# EAGLE design mainboard (EAGLE 7.2.0)
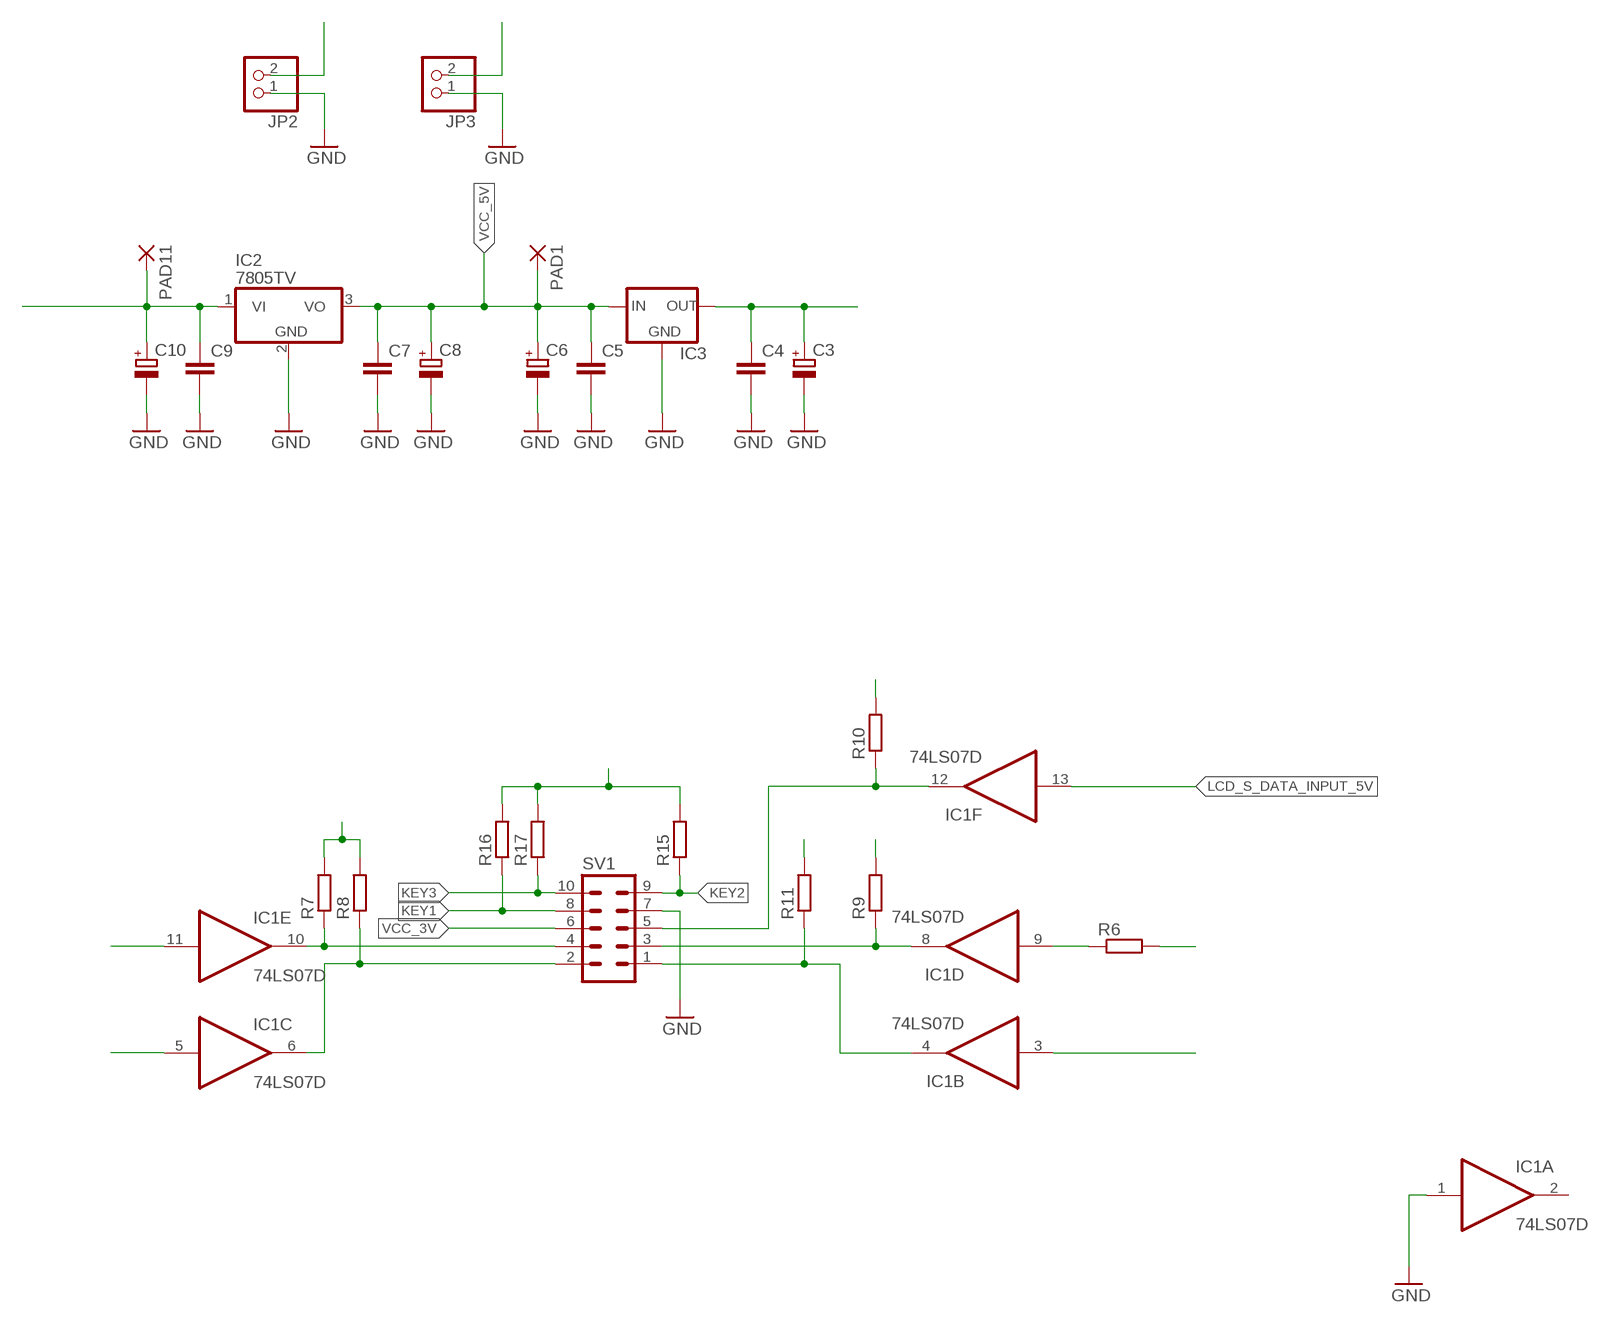
[diagram p0: schematic, sheet 1, part 1 of 2]
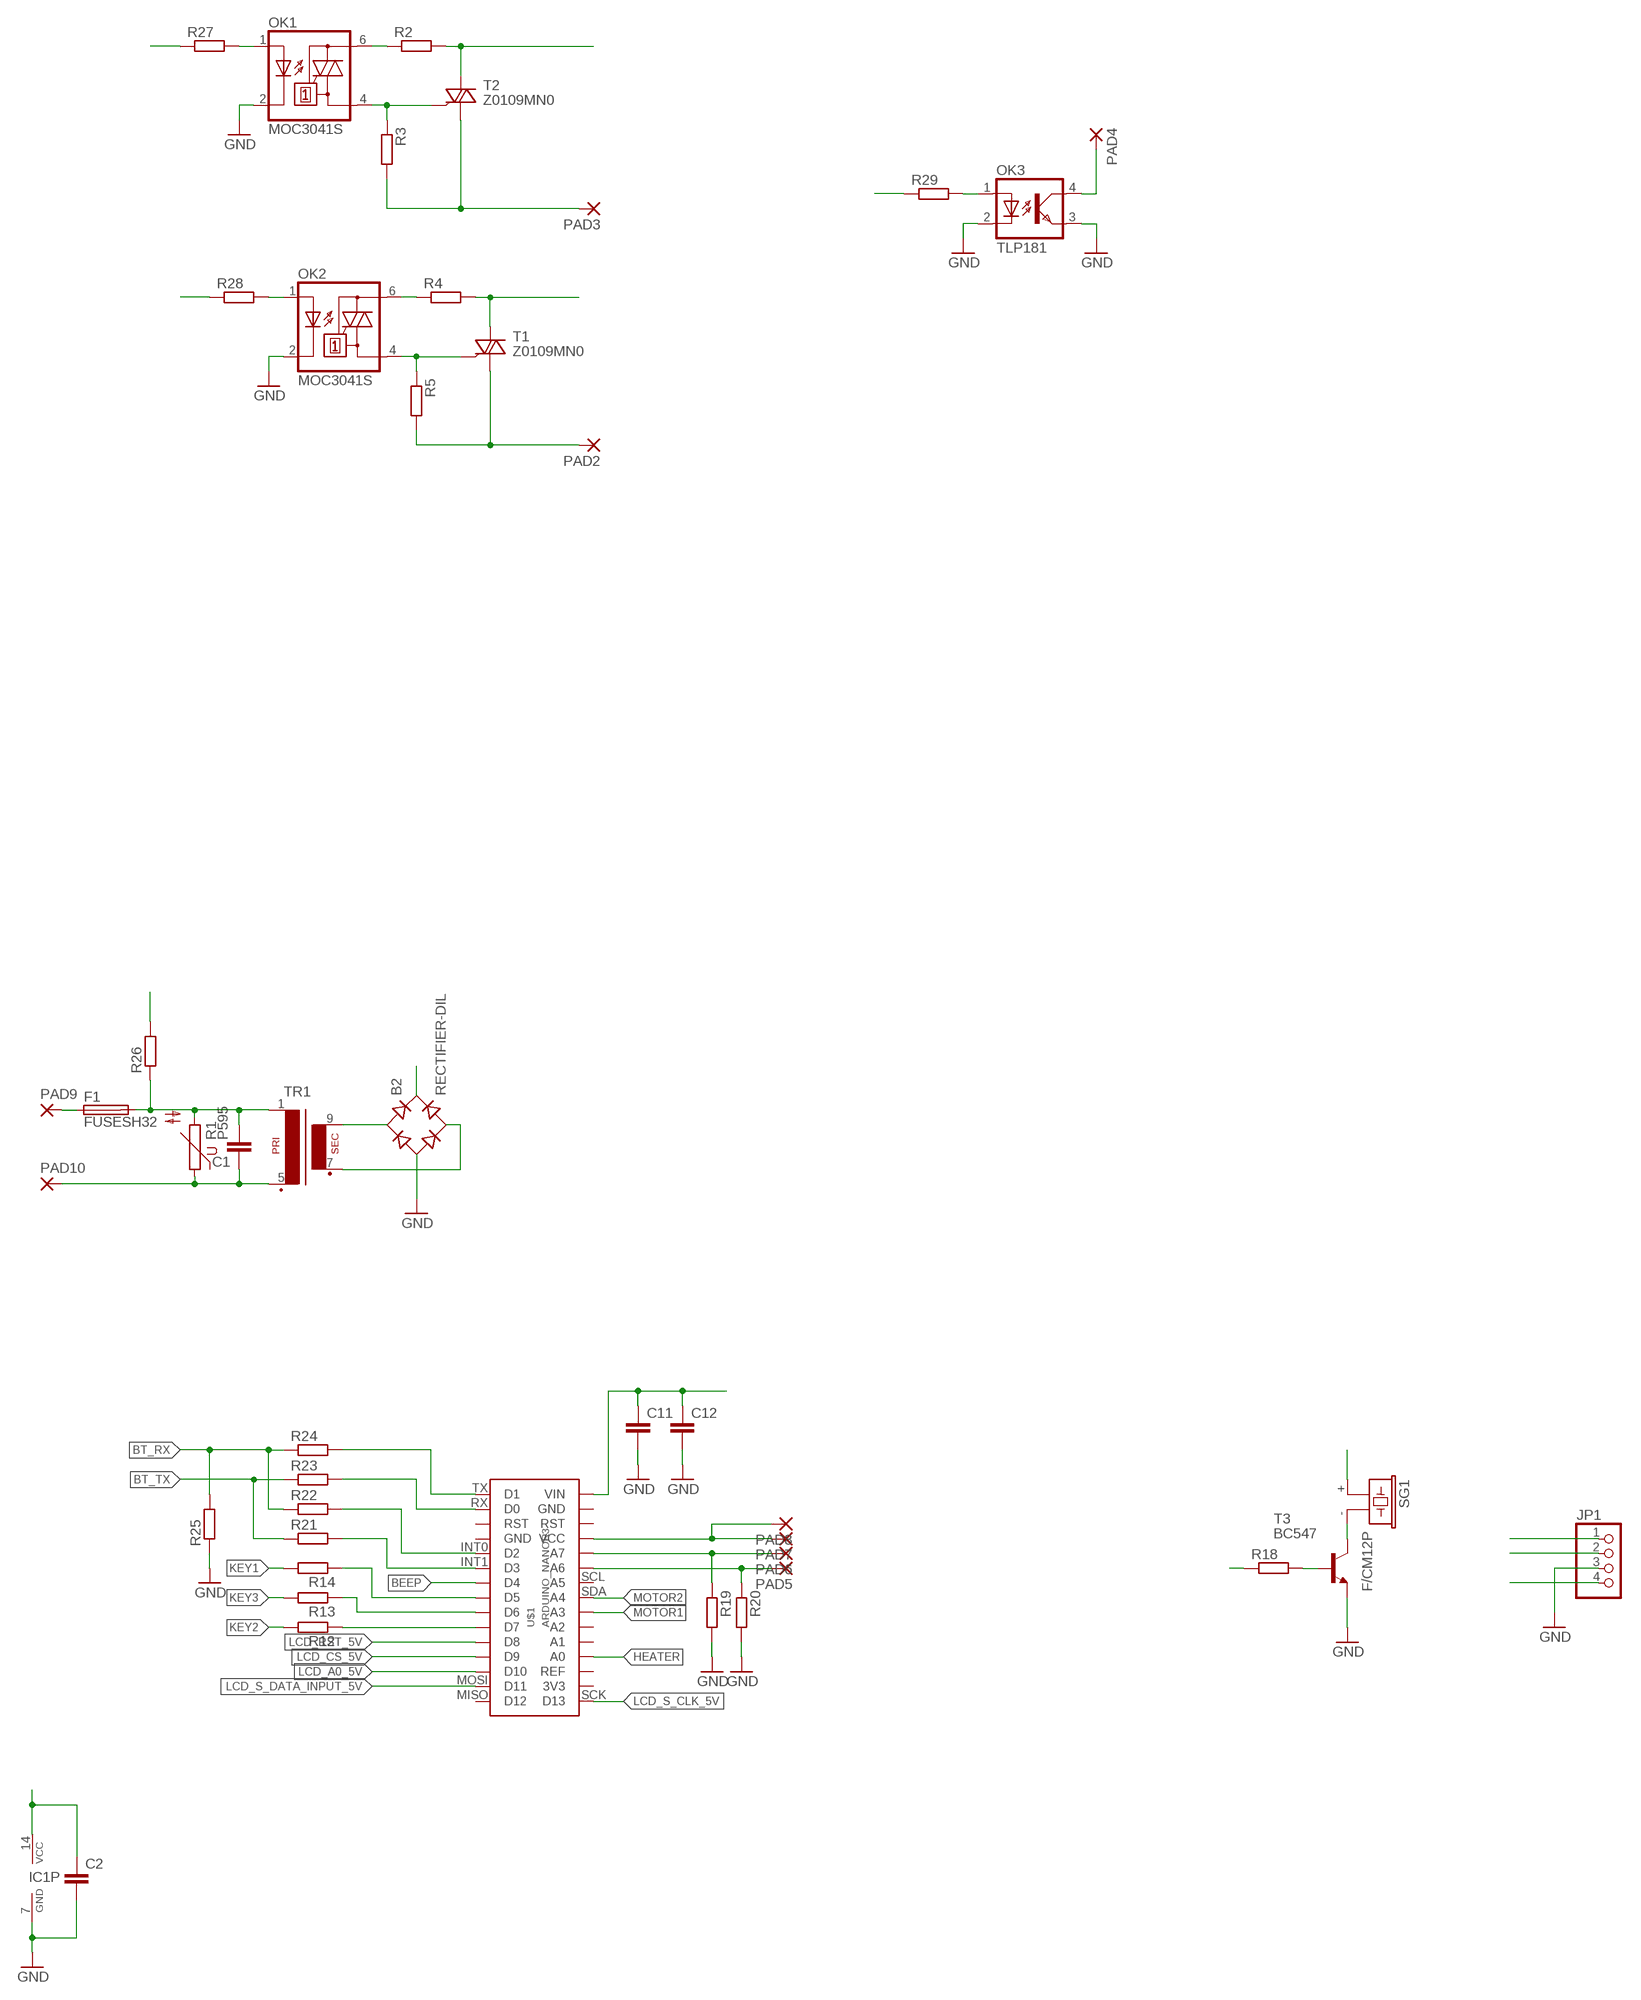
[diagram p1: schematic, sheet 1, part 2 of 2]

## Parts
B2  RECTIFIER-DIL  [B-DIL]
C1  C-EU150-054X183  [C150-054X183]
C2  C-EUC1206  [C1206]
C3  CPOL-EUSMCB  [SMC_B]
C4  C-EUC0603  [C0603]
C5  C-EUC0603  [C0603]
C6  CPOL-EUSMCB  [SMC_B]
C7  C-EUC1206  [C1206]
C8  CPOL-EUSMCC  [SMC_C]
C9  C-EUC1206  [C1206]
C10  CPOL-EU150CLZ-0810  [150CLZ-0810]
C11  C-EUC1206  [C1206]
C12  C-EUC1206  [C1206]
F1  FUSESH32  [SH32]
IC1  74LS07D  [SO14]
IC2  7805TV  [TO220V]
IC3  78XXS  [78XXS]
JP1  PINHD-1X4  [1X04]
JP2  PINHD-1X2  [1X02]
JP3  PINHD-1X2  [1X02]
OK1  MOC3041S  [DIL6-SMD]
OK2  MOC3041S  [DIL6-SMD]
OK3  TLP181  [SO-4]
PAD1  2,54/1,1  [2,54/1,1]
PAD2  2,54/1,1  [2,54/1,1]
PAD3  2,54/1,1  [2,54/1,1]
PAD4  2,54/1,1  [2,54/1,1]
PAD5  2,54/1,1  [2,54/1,1]
PAD6  2,54/1,1  [2,54/1,1]
PAD7  2,54/1,1  [2,54/1,1]
PAD8  2,54/1,1  [2,54/1,1]
PAD9  3,81/1,4  [3,81/1,4]
PAD10  3,81/1,4  [3,81/1,4]
PAD11  2,54/1,1  [2,54/1,1]
R1  P595  [P595]
R2  R-EU_R1206  [R1206]
R3  R-EU_R1206  [R1206]
R4  R-EU_R1206  [R1206]
R5  R-EU_R1206  [R1206]
R6  R-EU_R0603  [R0603]
R7  R-EU_R0603  [R0603]
R8  R-EU_R0603  [R0603]
R9  R-EU_0204/5  [0204/5]
R10  R-EU_0204/7  [0204/7]
R11  R-EU_R0603  [R0603]
R12  R-EU_0204/7  [0204/7]
R13  R-EU_0204/7  [0204/7]
R14  R-EU_0204/7  [0204/7]
R15  R-EU_R0603  [R0603]
R16  R-EU_R0603  [R0603]
R17  R-EU_R0603  [R0603]
R18  R-EU_0207/10  [0207/10]
R19  R-EU_0204/5  [0204/5]
R20  R-EU_0204/5  [0204/5]
R21  R-EU_R0603  [R0603]
R22  R-EU_R0603  [R0603]
R23  R-EU_R0603  [R0603]
R24  R-EU_R0603  [R0603]
R25  R-EU_R0603  [R0603]
R26  R-EU_VTA53  [VTA53]
R27  R-EU_0204/7  [0204/7]
R28  R-EU_0204/5  [0204/5]
R29  R-EU_R0603  [R0603]
SG1  F/CM12P  [F/CM12P]
SV1  ML10  [ML10]
T1  Z0109MN0  [SOT223]
T2  Z0109MN0  [SOT223]
T3  BC547  [TO92]
TR1  EI30-1  [EI30-1]
U$1  ARDUINO_NANOR3  [ARDUINO-NANO]

## Nets
BEEP: R18.1 U$1.D4
BT_RX: JP1.1 R22.1 R24.1 R25.2
BT_TX: JP1.2 R21.1 R23.1
G: OK2.4(A1) R5.1 T1.3(G)
GND: B2.- C2.2 C3.- C4.2 C5.2 C6.- C7.2 C8.- C9.2 C10.- C11.2 C12.2 IC1.1(A:I) IC1.7(P:GND) IC2.2(GND) IC3.GND JP1.3 JP2.1 JP3.1 OK1.2(C) OK2.2(C) OK3.2(C) OK3.3(EMIT) R19.2 R20.2 R25.1 SV1.7 T3.1(E)
HEATER: R29.1 U$1.A0
KEY1: R14.2 R16.1 SV1.8
KEY2: R12.2 R15.1 SV1.9
KEY3: R13.2 R17.1 SV1.10
LCD_A0: IC1.8(D:O) R9.1 SV1.3
LCD_A0_5V: R6.2 U$1.D10
LCD_CS_3V: IC1.4(B:O) R11.1 SV1.1
LCD_CS_5V: IC1.3(B:I) U$1.D9
LCD_RST_3V: IC1.6(C:O) R8.1 SV1.2
LCD_RST_5V: IC1.5(C:I) U$1.D8
LCD_S_CLK: IC1.10(E:O) R7.1 SV1.4
LCD_S_CLK_5V: IC1.11(E:I) U$1.SCK(D13)
LCD_S_DATA_INPUT: IC1.12(F:O) R10.1 SV1.5
LCD_S_DATA_INPUT_5V: IC1.13(F:I) U$1.MOSI(D11)
MOTOR1: R27.1 U$1.A3
MOTOR2: R28.1 U$1.SDA(A4)
N$1: C1.1 PAD10.1(P) R1.1 TR1.5(P2)
N$2: C1.2 F1.2A R1.2 R26.1 TR1.1
N$3: B2.AC1 TR1.9(S4)
N$4: B2.AC2 TR1.7(S3)
N$5: OK1.6(A2) R2.1
N$6: OK1.4(A1) R3.1 T2.3(G)
N$7: OK2.6(A2) R4.1
N$8: R21.2 U$1.INT1(D3)
N$10: F1.1A PAD9.1(P)
N$11: IC1.9(D:I) R6.1
N$12: R12.1 U$1.D7
N$13: R13.1 U$1.D6
N$14: R14.1 U$1.D5
N$15: PAD5.1(P) R20.1 U$1.A6
N$16: PAD6.1(P) R19.1 U$1.A7
N$17: R22.2 U$1.INT0(D2)
N$18: R23.2 U$1.RX(D0)
N$19: R24.2 U$1.TX(D1)
N$20: SG1.- T3.3(C)
N$22: R18.2 T3.2(B)
N$23: OK1.1(A) R27.2
N$24: OK2.1(A) R28.2
N$25: OK3.1(A) R29.2
N$26: OK3.4(COL) PAD4.1(P)
N$30: PAD2.1(P) R5.2 T1.2(CM) T1.4(CM)
N$31: PAD3.1(P) R3.2 T2.2(CM) T2.4(CM)
VCC_3V: C3.+ C4.1 IC3.OUT R7.2 R8.2 R9.2 R10.2 R11.2 SV1.6
VCC_5V: C5.1 C6.+ C7.1 C8.+ IC2.3(VO) IC3.IN JP1.4 JP2.2 PAD1.1(P) R15.2 R16.2 R17.2 SG1.+
VCC_5V_ARDUINO: C2.1 IC1.14(P:VCC) PAD7.1(P) PAD8.1(P) U$1.VCC
VIN: B2.+ C9.1 C10.+ C11.1 C12.1 IC2.1(VI) JP3.2 PAD11.1(P) U$1.VIN
WN: R2.2 R4.2 R26.2 T1.1(LD) T2.1(LD)
Unconnected: IC1.2(A:O) U$1.A1 U$1.A2 U$1.MISO(D12) U$1.REF U$1.RST@1(RST) U$1.RST@2(RST) U$1.SCL(A5)

## Power pins joined to a net without a drawn wire
3V3: U$1.3V3
GND: U$1.GND@1(GND) U$1.GND@2(GND)

## Library data of the parts
B2 = rectifier:RECTIFIER-: Rectifier
C1 C2 C4 C5 C7 C9 C11 C12 = rcl:C-EU: CAPACITOR, European symbol
C3 C6 C8 C10 = rcl:CPOL-EU: POLARIZED CAPACITOR, European symbol
F1 = fuse:FUSE: Fuse; OC_FARNELL: unknown; OC_NEWARK: unknown
IC1 = 74xx-eu:74*07: Hex BUFFER, open collector high-voltage output
IC2 = linear:78*: Positive VOLTAGE REGULATOR Source: http://cache.national.com/ds/LM/LM78L05.pdf http://www.fairchildsemi.com/ds/LM/LM7805.pdf
IC3 = v-reg:78XXS: VOLTAGE REGULATOR
JP1 = pinhead:PINHD-1X4: PIN HEADER
JP2 JP3 = pinhead:PINHD-1X2: PIN HEADER
OK1 OK2 = optocoupler:MOC30*: 6-Pin DIP Zero-Cross Optoisolators Triac Driver Output (250/400 Volt Peak) Source: http://www.fairchildsemi.com/ds/MO/MOC3043-M.pdf; MF: FAIRCHILD SEMICONDUCTOR; MPN: MOC3041S-M; OC_FARNELL: unknown; OC_NEWARK: 05C2885
OK3 = optocoupler-2:TLP181
PAD1-PAD8 PAD11 = wirepad:2,54/1,1: THROUGH-HOLE PAD
PAD9 PAD10 = wirepad:3,81/1,4: THROUGH-HOLE PAD
R1 = varistor:P595: VARISTOR
R2-R29 = rcl:R-EU_: RESISTOR, European symbol
SG1 = buzzer:F/CM12P: BUZZER Source: Buerklin; OC_FARNELL: unknown; OC_NEWARK: unknown
SV1 = con-harting-ml:ML10: HARTING; OC_FARNELL: unknown; OC_NEWARK: unknown
T1 T2 = nxp_60_1_1:Z0109MN0: 4Q Triac Planar passivated sensitive gate four quadrant triac in a SOT223 (SC-73) surface-mountable plastic package intended for applications requiring enhanced immunity to noise and direct interfacing to logic level ICs and low power gate drivers. AAL Eindhoven MK; 12NC: 9340 650 56135
T3 = transistor:BC547: NPN TRANSISTOR
TR1 = trafo:EI30-1: TRANSFORMER 1 primary winding, 1 secondary winding ERA
U$1 = aldar:ARDUINO_NANO: Arduino NANO R3

## Board
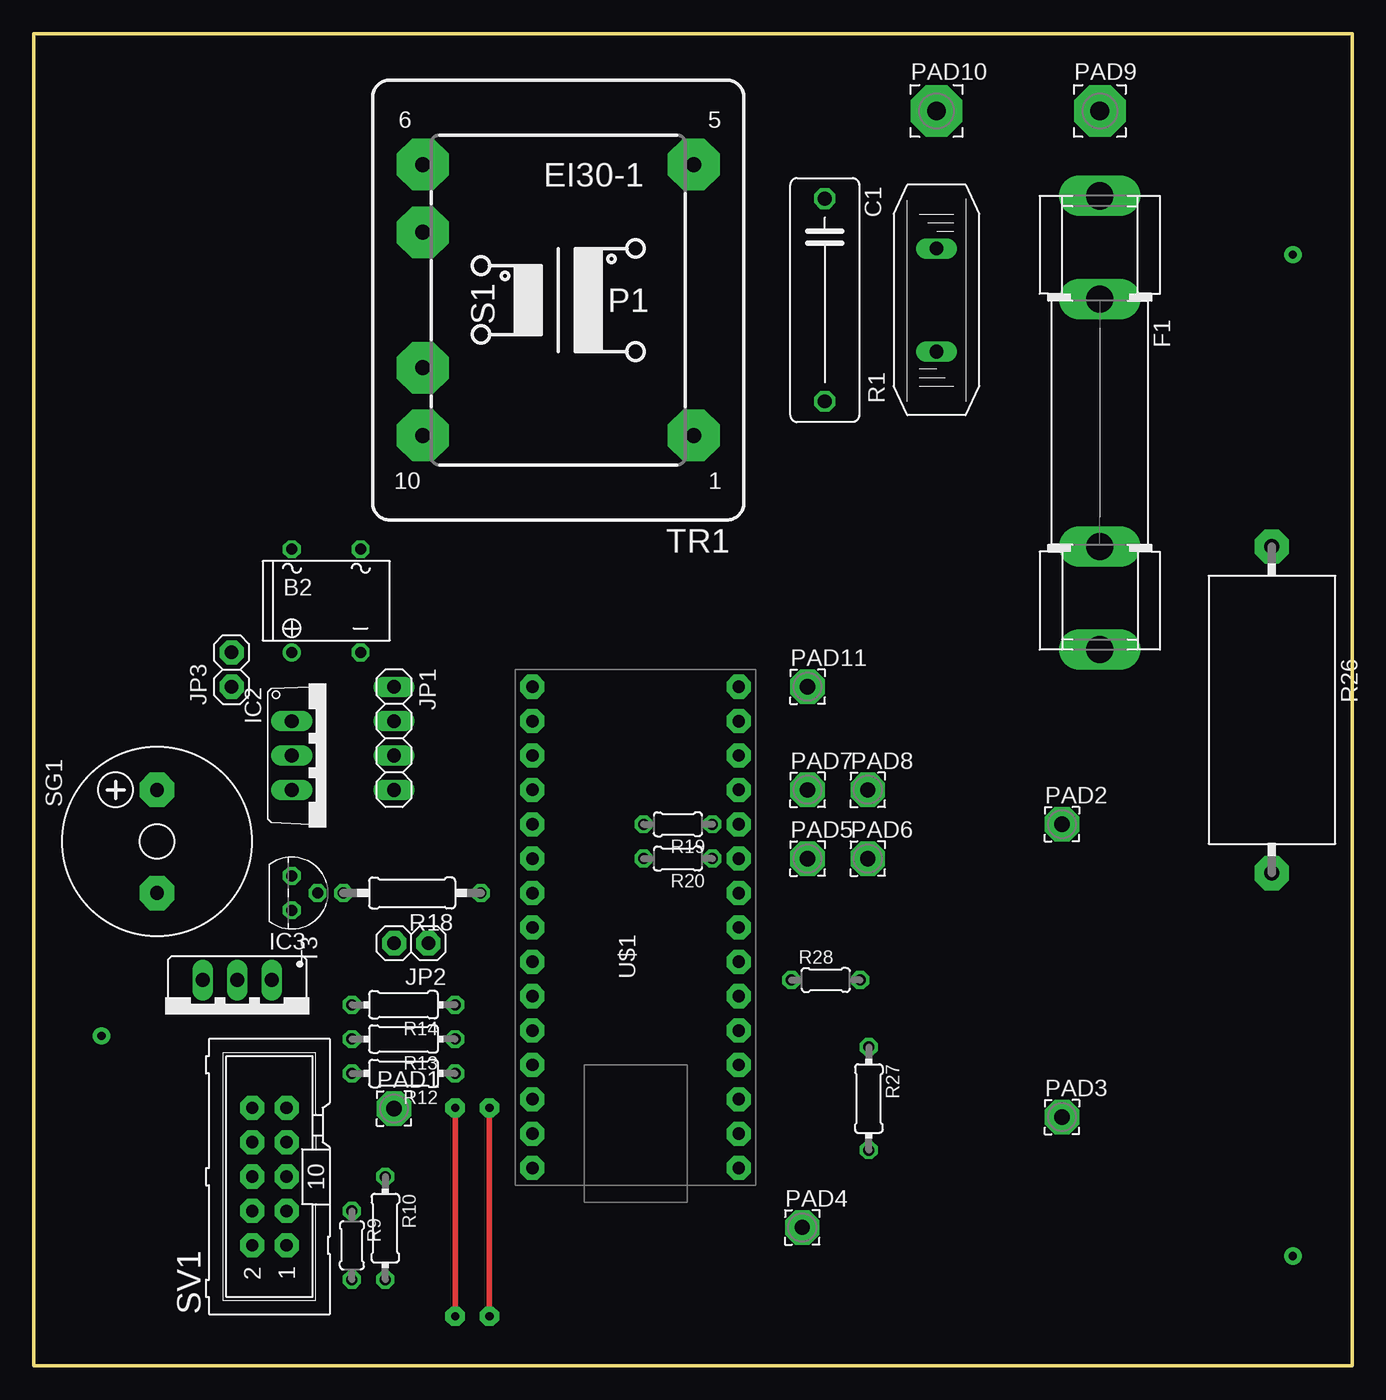
[diagram p2: board, top side]
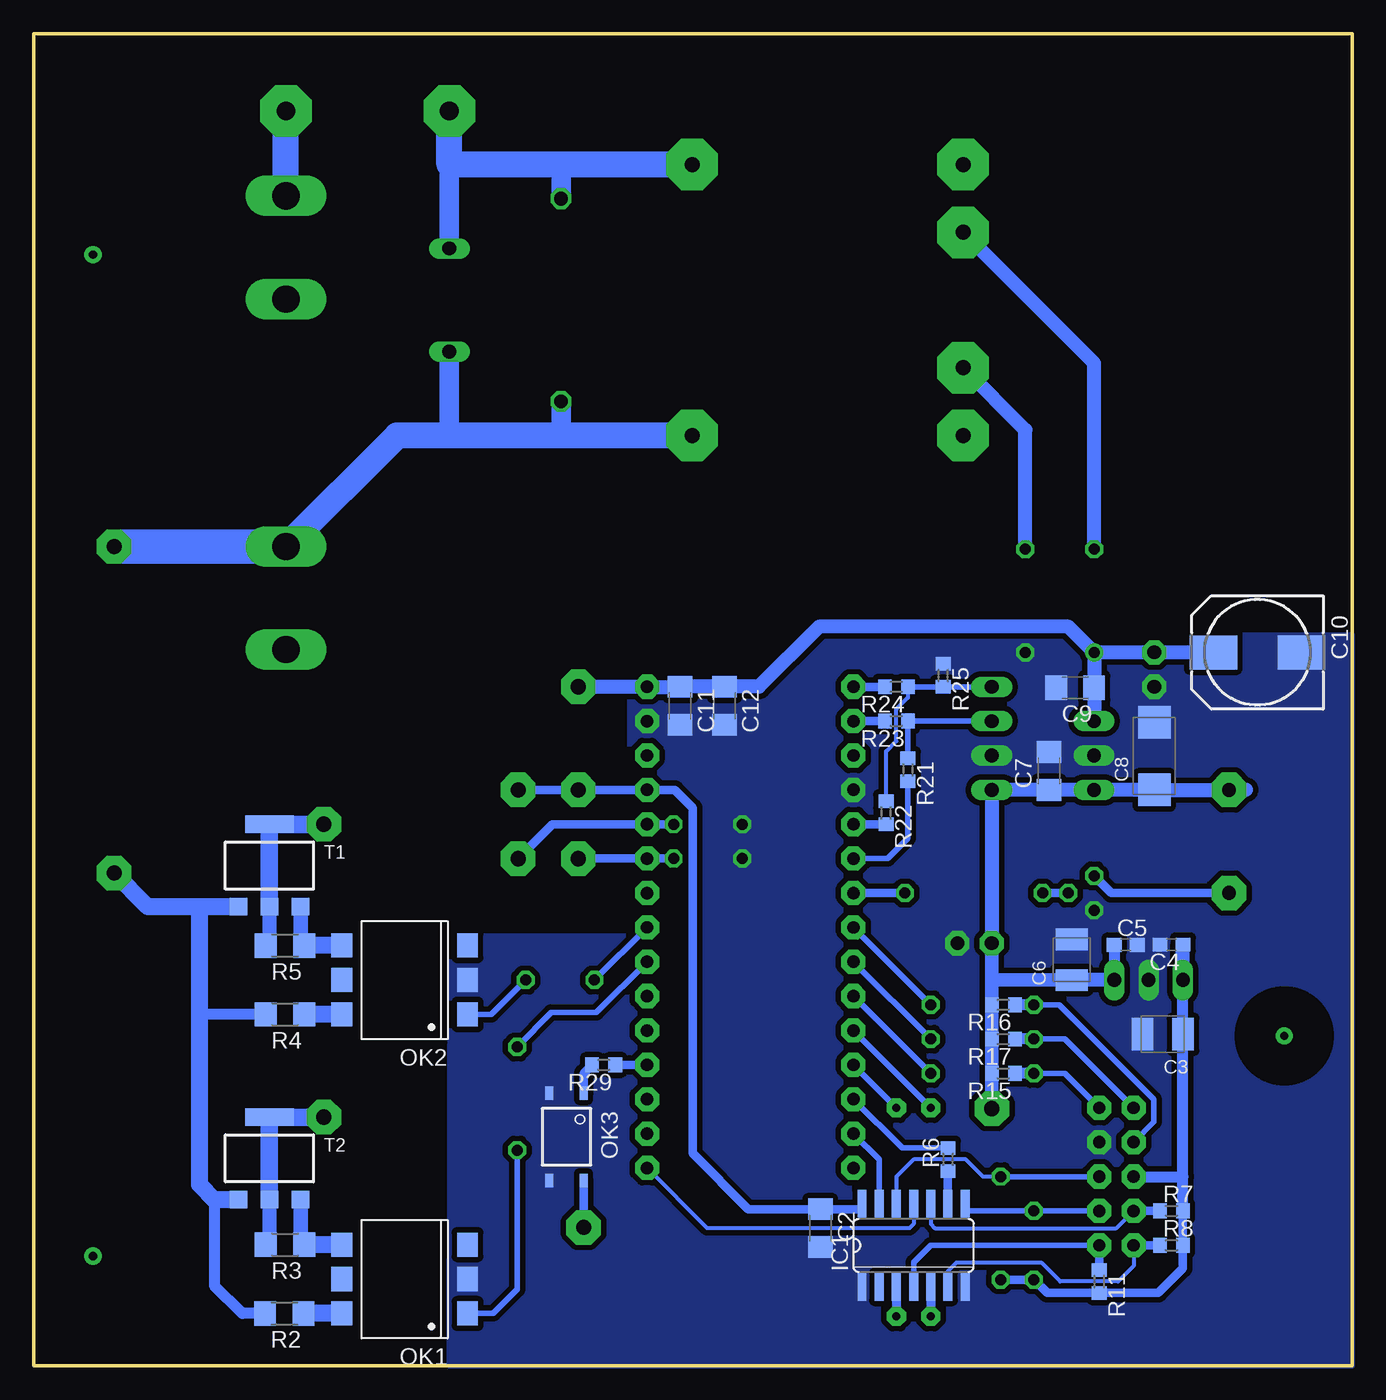
[diagram p3: board, bottom side, seen from below]

Size 97.36 x 98.41 mm. Coordinates in mm from the lower left corner, seen from the top.
Outline: 0,0 97.36,0 97.36,98.41 0,98.41 0,0
Copper layers (1*16): Top 0.035mm / dielectric 1.5mm / Bottom 0.035mm
Design rules "default *": minimum track width 10mil, minimum drill 24mil, track to track 8mil, track to pad 8mil, pad to pad 8mil, via to via 8mil, smd to smd 8mil, copper to edge 0mil, drill to drill 8mil, minimum pad ring 10mil, minimum via ring 8mil, stop-mask expansion 4mil, vias tented up to drill 0mil, thermal gap 10mil
bRestrict: area 2,21.3 to 8,27.4

### Footprints (pad centres in the part's own frame; a part is rotated, then mirrored left to right if it is on the bottom)
B-DIL = drill 0.813: + -2.54,-3.81 | drill 0.813 octagon: - 2.54,-3.81; AC1 2.54,3.81; AC2 -2.54,3.81
C150-054X183 = drill 1.016 octagon: 1 -7.493,0; 2 7.493,0
C1206 = smd 1.6 x 1.8: 1 -1.4,0; 2 1.4,0
SMC_B = smd 1.6 x 2.4: + -1.5,0; - 1.5,0
C0603 = smd 1.1 x 1: 1 -0.85,0; 2 0.85,0
SMC_C = smd 2.4 x 2.4: + -2.5,0; - 2.5,0
150CLZ-0810 = smd 3.5 x 2.5: + 3.25,0; - -3.25,0
SH32 = drill 2.007 long: 1A -16.764,0; 1B -9.144,0; 2A 9.144,0; 2B 16.764,0
SO14 = smd 0.66 x 2.032: 1 -3.81,-3.073; 2 -2.54,-3.073; 3 -1.27,-3.073; 4 0,-3.073; 5 1.27,-3.073; 6 2.54,-3.073; 7 3.81,-3.073; 8 3.81,3.073; 9 2.54,3.073; 10 1.27,3.073; 11 0,3.073; 12 -1.27,3.073; 13 -2.54,3.073; 14 -3.81,3.073
TO220V = drill 1.016 long: 1 -2.54,-2.54; 2 0,-2.54; 3 2.54,-2.54
78XXS = drill 1.016 long: GND 0,-2.54; IN -2.54,-2.54; OUT 2.54,-2.54
1X04 = drill 1.016 long: 1 -3.81,0; 2 -1.27,0; 3 1.27,0; 4 3.81,0
1X02 = drill 1.016 pad 1.778 octagon: 1 -1.27,0; 2 1.27,0
DIL6-SMD = smd 1.78 x 1.52: 1 -2.54,-4.645; 2 0,-4.645; 3 2.54,-4.645; 4 2.54,4.645; 5 0,4.645; 6 -2.54,4.645
SO-4 = smd 1 x 0.6: 1 -3.24,0.635; 2 -3.24,-1.905; 3 3.24,-1.905; 4 3.24,0.635
2,54/1,1 = drill 1.118 pad 2.54 octagon: 1 0,0
3,81/1,4 = drill 1.397 pad 3.81 octagon: 1 0,0
P595 = drill 1.016 long: 1 0,3.81; 2 0,-3.81
R1206 = smd 1.6 x 1.803: 1 -1.422,0; 2 1.422,0
R0603 = smd 1 x 1.1: 1 -0.85,0; 2 0.85,0
0204/5 = drill 0.813 octagon: 1 -2.54,0; 2 2.54,0
0204/7 = drill 0.813 octagon: 1 -3.81,0; 2 3.81,0
0207/10 = drill 0.813 octagon: 1 -5.08,0; 2 5.08,0
VTA53 = drill 1.1 pad 2.54 octagon: 1 -12.065,0; 2 12.065,0
F/CM12P = drill 1.016 pad 2.54 octagon: + 3.81,0; - -3.81,0
ML10 = drill 0.914 pad 1.778 octagon: 1 -5.08,-1.27; 2 -5.08,1.27; 3 -2.54,-1.27; 4 -2.54,1.27; 5 0,-1.27; 6 0,1.27; 7 2.54,-1.27; 8 2.54,1.27; 9 5.08,-1.27; 10 5.08,1.27
SOT223 = smd 1.3 x 1.3: 1 -2.3,-3.05; 2 0,-3.05; 3 2.3,-3.05 | smd 3.6 x 1.3: 4 0,3.05
TO92 = drill 0.813 octagon: 1 1.27,0; 2 0,1.905; 3 -1.27,0
EI30-1 = drill 1.118 pad 3.81 octagon: 1 -10.008,10.008; 5 -10.008,-10.008; 6 10.008,-10.008; 7 10.008,-5.004; 9 10.008,5.004; 10 10.008,10.008
ARDUINO-NANO = drill 0.914 pad 1.778 octagon: 3V3 -15.24,-7.62; A0 -10.16,-7.62; A1 -7.62,-7.62; A2 -5.08,-7.62; A3 -2.54,-7.62; A6 5.08,-7.62; A7 7.62,-7.62; D4 2.54,7.62; D5 0,7.62; D6 -2.54,7.62; D7 -5.08,7.62; D8 -7.62,7.62; D9 -10.16,7.62; D10 -12.7,7.62; GND@1 10.16,7.62; GND@2 15.24,-7.62; INT0 7.62,7.62; INT1 5.08,7.62; MISO -17.78,7.62; MOSI -15.24,7.62; REF -12.7,-7.62; RST@1 12.7,7.62; RST@2 12.7,-7.62; RX 15.24,7.62; SCK -17.78,-7.62; SCL 2.54,-7.62; SDA 0,-7.62; TX 17.78,7.62; VCC 10.16,-7.62; VIN 17.78,-7.62

### Placement (x,y rotation side)
B2  21.59,56.52 0 top
C1  58.42,78.74 270 top
C2  39.27,10.16 270 bottom
C3  13.98,24.49 180 bottom
C4  13.34,31.11 180 bottom
C5  16.71,31.09 0 bottom
C6  20.7,30 90 bottom
C7  22.38,43.94 90 bottom
C8  14.61,45.05 90 bottom
C9  20.45,50.09 180 bottom
C10  6.99,52.7 180 bottom
C11  49.63,48.77 270 bottom
C12  46.35,48.77 270 bottom
F1  78.74,69.67 270 top
IC1  32.38,8.89 0 bottom
IC2  21.59,45.09 270 top
IC3  15.02,25.96 180 top
JP1  26.61,46.35 270 top
JP2  27.88,31.22 180 top
JP3  14.61,51.44 90 top
OK1  69.98,6.4 90 bottom
OK2  69.98,28.5 90 bottom
OK3  57.39,16.92 270 bottom
PAD1  26.61,19 0 top
PAD2  75.95,40.01 0 top
PAD3  75.95,18.37 0 top
PAD4  56.76,10.21 0 top
PAD5  57.15,37.47 0 top
PAD6  61.59,37.47 0 top
PAD7  57.15,42.55 0 top
PAD8  61.59,42.55 0 top
PAD9  78.74,92.71 0 top
PAD10  66.67,92.71 0 top
PAD11  57.15,50.16 0 top
R1  66.67,78.74 0 top
R2  78.87,3.86 180 bottom
R3  78.82,8.94 180 bottom
R4  78.82,25.96 180 bottom
R5  78.82,31.04 180 bottom
R6  29.84,15.24 90 bottom
R7  13.34,11.43 0 bottom
R8  13.34,8.89 0 bottom
R9  23.5,8.89 270 top
R10  25.96,10.16 270 top
R11  18.67,6.22 270 bottom
R12  27.3,21.59 180 top
R13  27.3,24.13 180 top
R14  27.3,26.67 180 top
R15  25.76,21.59 180 bottom
R16  25.76,26.67 180 bottom
R17  25.76,24.13 180 bottom
R18  27.94,34.92 180 top
R19  47.57,40.01 180 top
R20  47.57,37.47 180 top
R21  32.8,44.02 270 bottom
R22  34.42,40.84 270 bottom
R23  33.66,47.62 180 bottom
R24  33.66,50.16 180 bottom
R25  30.2,51 270 bottom
R26  91.44,48.46 270 top
R27  61.67,19.74 270 top
R28  58.5,28.5 0 top
R29  55.27,22.23 180 bottom
SG1  9.09,38.73 90 top
SV1  17.4,13.97 90 top
T1  79.96,36.96 0 bottom
T2  79.96,15.32 0 bottom
T3  19.05,34.92 270 top
TR1  38.73,78.74 180 top
U$1  44.45,32.38 90 top

### Tracks (layer width: path | path; a pad name or v marks a point on that pad's centre or on a via)
BEEP
  Bottom 0.61: R18.1 U$1.D4
BT_RX
  Bottom 0.305: R22.1 34.42,45.39 33.66,46.15 33.66,48.51 32.8,49.36 R24.1 | R25.2 30.47,50.15 30.48,50.16
  Bottom 0.406: R24.1 30.48,50.16 JP1.1
BT_TX
  Bottom 0.406: R21.1 R23.1 JP1.2
G
  Bottom 0.813: 77.66,31.3 R5.1
  Bottom 1.072: T1.3 77.66,31.3
  Bottom 1.27: OK2.4 R5.1
GND
  pour Bottom (isolate 0.406, no thermals): 0,53.98 0,0 66.67,0 66.6,31.75 49.53,31.75 49.53,40.64 53.34,44.45 53.34,50.16 48.26,55.24 20.32,55.24 19.05,53.98
HEATER
  Bottom 0.61: U$1.A0 R29.1
KEY1
  Bottom 0.406: SV1.8 14.63,18.01 14.63,19.68 21.61,26.67 R14.2
  Bottom 0.813: R14.2 R16.1
KEY2
  Bottom 0.406: R12.2 21.21,21.59 SV1.9
  Bottom 0.813: R12.2 R15.1
KEY3
  Bottom 0.406: R13.2 21.21,24.13 SV1.10
  Bottom 0.813: R13.2 R17.1
LCD_A0
  Bottom 0.406: SV1.3 R9.1 28.57,11.43 IC1.8
LCD_A0_5V
  Bottom 0.406: R6.2 33.23,16.09 U$1.D10
LCD_CS_3V
  Bottom 0.406: SV1.1 31.11,8.89 32.38,7.62 IC1.4
  Bottom 0.61: R11.1 SV1.1
LCD_CS_5V  (via drill 0.6 pad 1.42)
  Top 0.406: v33.66,19.05 v33.66,3.66
  Bottom 0.406: v33.66,19.05 U$1.D9
  Bottom 0.66: IC1.3 v33.66,3.66
LCD_RST_3V
  Bottom 0.305: IC1.6 29.84,6.99 29.21,7.62 22.96,7.62 21.57,6.22 17.27,6.22 16.13,7.37 SV1.2
  Bottom 0.61: R8.1 SV1.2
LCD_RST_5V  (via drill 0.6 pad 1.42)
  Top 0.406: v31.11,19.05 v31.11,3.66
  Bottom 0.406: v31.11,19.05 U$1.D8
  Bottom 0.66: IC1.5 v31.11,3.66
LCD_S_CLK
  Bottom 0.305: IC1.10 31.11,10.46 30.81,10.16 17.4,10.16 SV1.4
  Bottom 0.61: R7.1 SV1.4
LCD_S_CLK_5V
  Bottom 0.305: IC1.11 32.38,10.46 32.69,10.16 47.62,10.16 U$1.SCK
LCD_S_DATA_INPUT
  Bottom 0.305: IC1.12 33.66,13.97 32.38,15.24 28.52,15.24 27.25,13.97 R10.1
  Bottom 0.406: SV1.5 R10.1
LCD_S_DATA_INPUT_5V
  Bottom 0.406: IC1.13 34.92,15.24 U$1.MOSI
MOTOR1
  Bottom 0.406: U$1.A3 55.83,26.09 59.13,26.09 R27.1
MOTOR2
  Bottom 0.406: U$1.SDA R28.1
N$1
  Bottom 1.422: C1.1 58.42,88.75 | R1.1 66.67,88.75
  Bottom 1.93: TR1.5 58.42,88.75 66.67,88.75 PAD10.1
N$2
  Bottom 1.422: C1.2 58.42,68.73 | R1.2 66.67,68.73
  Bottom 1.93: TR1.1 58.42,68.73 66.67,68.73 70.54,68.73 F1.2A
  Bottom 2.54: F1.2A R26.1
N$3
  Bottom 1.016: B2.AC1 24.13,69.14 TR1.9
N$4
  Bottom 1.016: B2.AC2 19.05,74.07 TR1.7
N$5
  Bottom 1.27: OK1.6 R2.1
N$6
  Bottom 0.813: 77.66,9.21 R3.1
  Bottom 1.072: T2.3 77.66,9.21
  Bottom 1.27: OK1.4 R3.1
N$7
  Bottom 1.27: OK2.6 R4.1
N$8
  Bottom 0.406: R21.2 32.8,38.95 34.29,37.47 U$1.INT1
N$10
  Bottom 1.93: F1.1A PAD9.1
N$11
  Bottom 0.61: IC1.9 R6.1
N$12
  Bottom 0.406: R12.1 U$1.D7
N$13
  Bottom 0.406: R13.1 U$1.D6
N$14
  Bottom 0.406: R14.1 U$1.D5
N$15
  Bottom 0.61: R20.1 U$1.A6 PAD5.1
N$16
  Bottom 0.61: R19.1 U$1.A7 59.05,40.01 PAD6.1
N$17
  Bottom 0.61: U$1.INT0 34.43,40.01 R22.2
N$18
  Bottom 0.61: R23.2 U$1.RX
N$19
  Bottom 0.61: R24.2 U$1.TX
N$20
  Bottom 0.61: SG1.- 17.78,34.92 T3.3
N$22
  Bottom 0.61: T3.2 R18.2
N$23
  Bottom 0.406: R27.2 61.67,5.64 63.45,3.86 OK1.1
N$24
  Bottom 0.406: OK2.1 63.58,25.96 R28.2
N$25
  Bottom 0.61: R29.2 56.76,21.59 OK3.1
N$26
  Bottom 0.61: PAD4.1 OK3.4
N$27  (via drill 0.6 pad 1.27)
  other vias: 5,24.36
N$28  (via drill 0.6 pad 1.27)
  other vias: 93,8.1
N$29  (via drill 0.6 pad 1.27)
  other vias: 93,82.09
N$30
  Bottom 0.813: 79.96,31.32 R5.2
  Bottom 1.046: T1.2 79.96,31.32
  Bottom 1.295: PAD2.1 T1.4
  Bottom 1.3: T1.2 T1.4
N$31
  Bottom 0.813: 79.96,9.22 R3.2 | T2.4
  Bottom 1.046: T2.2 79.96,9.22
  Bottom 1.295: T2.4 PAD3.1
  Bottom 1.3: T2.2 T2.4
VCC_3V
  Bottom 0.61: R7.2 R8.2 12.48,7.2 14.31,5.37 R11.2 22.52,5.37 R9.2 R10.2 | C3.+
  Bottom 0.813: R7.2 12.48,13.97 | SV1.6 12.48,13.97 | C3.+ IC3.OUT | 12.48,13.97 C3.+ | IC3.OUT
  Bottom 1.016: IC3.OUT C4.1
VCC_5V
  Bottom 0.406: 22.86,42.54 22.86,42.55 | C7.1 22.23,42.54 22.23,42.55
  Bottom 0.61: C6.+ | C5.1
  Bottom 0.813: C6.+ | C5.1 IC3.IN
  Bottom 0.999: JP2.2 26.61,28.57 | 26.61,28.57 R16.2 R17.2 R15.2 PAD1.1 | C6.+ 26.53,28.5 26.61,28.57
  Bottom 1.016: IC3.IN C6.+ | C5.1 | JP1.4 22.86,42.55 22.23,42.55 IC2.3 C8.+ 7.83,42.55 SG1.+ | JP1.4 | JP1.4 JP2.2
VCC_5V_ARDUINO
  Bottom 0.61: IC1.14 36.2,11.56 C2.1 44.58,11.56 48.69,15.67 48.69,41.22 50.01,42.55 U$1.VCC PAD7.1 PAD8.1
VIN
  Bottom 1.016: B2.+ 20.95,54.61 39.37,54.61 43.81,50.16 C12.1 C11.1 | B2.+ C9.1 IC2.1 | C11.1 U$1.VIN PAD11.1 | C11.1 | C10.+ JP3.2 B2.+
WN
  Bottom 0.813: R2.2 81.97,3.86 84.02,5.92 84.02,12.27 | R4.2 85.06,25.96 85.14,25.4
  Bottom 1.27: T1.1 85.14,33.91 | 85.14,33.91 85.14,25.4 85.14,13.38 84.02,12.27 T2.1 | 85.14,33.91 88.95,33.91 R26.2